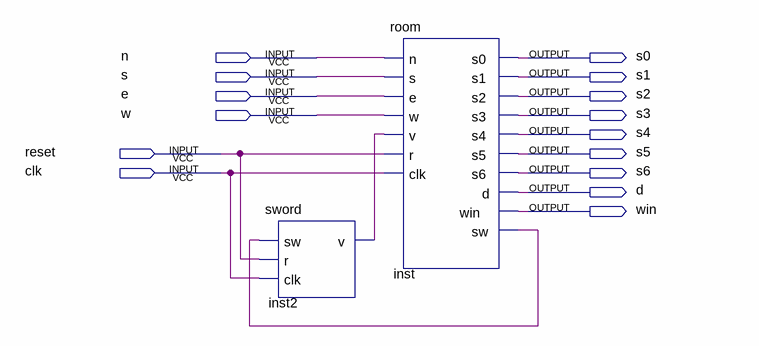
[diagram p0: schematic sheet]
// Quartus schematic lab3_BF.bdf as structural Verilog: 2 symbols, 15 pins
module lab3_BF (
  input  n,
  input  s,
  input  e,
  input  w,
  input  reset,
  input  clk,
  output s0,
  output s1,
  output s2,
  output s3,
  output s4,
  output s5,
  output s6,
  output d,
  output win
);

  wire inst2_v, inst_sw;

  sword inst2 (.sw(inst_sw), .r(reset), .clk(clk), .v(inst2_v));
  room inst (
    .n(n), .s(s), .e(e), .w(w), .v(inst2_v), .r(reset), .clk(clk), .s0(s0), .s1(s1), .s2(s2), .s3(s3),
    .s4(s4), .s5(s5), .s6(s6), .d(d), .win(win), .sw(inst_sw));
endmodule
